# Altium schematic sheet event_loading.SchDoc
size A4; Revision: V0.1 Rev A; SheetNumber: 4; SheetTotal: 9
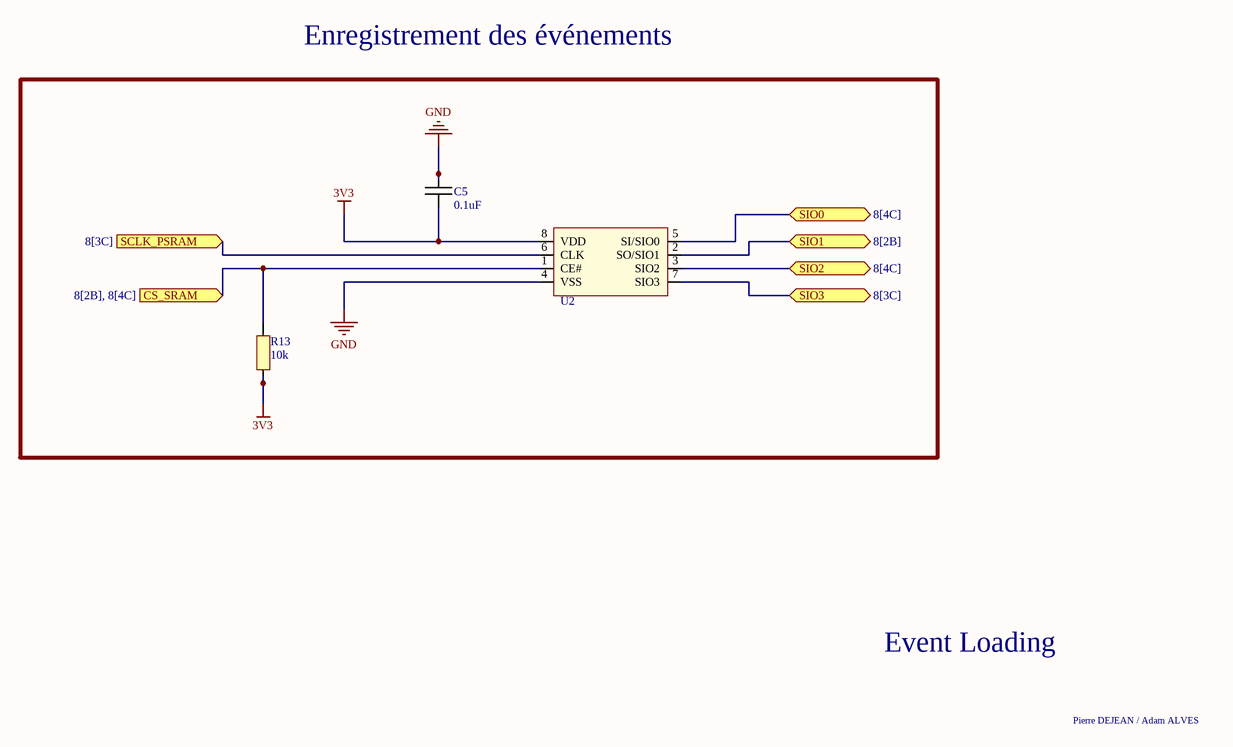
[diagram p0: event_loading.SchDoc]

## Parts
C5  0.1uF  [CAPC1005X06N]
R13  10k  [RESC1005X06N]
U2  IS66WVS1M8BLL-104NLI  [SOIC127P600X175-8N]  (value not drawn)

## Ports
CS_SRAM (in, see 8[2B], 8[4C]), SCLK_PSRAM (in, see 8[3C]), SIO0 (bidir, see 8[4C]), SIO1 (bidir, see 8[2B]), SIO2 (bidir, see 8[4C]), SIO3 (bidir, see 8[3C])

## Nets
3V3: C5.2 R13.1 U2.8(VDD)
GND: C5.1 U2.4(VSS)
CS_SRAM: R13.2 U2.1(CE#) ; port CS_SRAM
SCLK_PSRAM: U2.6(CLK) ; port SCLK_PSRAM
SIO0: U2.5(SI/SIO0) ; port SIO0
SIO1: U2.2(SO/SIO1) ; port SIO1
SIO2: U2.3(SIO2) ; port SIO2
SIO3: U2.7(SIO3) ; port SIO3

## Notes on the sheet
- Enregistrement des événements
- Event Loading
- Pierre DEJEAN / Adam ALVES

## Library data of the parts
C5 = Capacitor
R13 = Resistor
U2 = SRAM: SRAM 8Mb, SerialRAM, 2.7V-3.6V, 104MHz, 8 pin SOIC 150 mil, RoHS; Manufacturer 1: ISSI; Supplier 1: Digi-Key; Supplier Part Number 1: 706-IS66WVS1M8BLL-104NLI-ND; Manufactuer Part Number 1: IS66WVS1M8BLL-104NLI